# Altium schematic sheet Current Voltage Sensors.SchDoc
size A4
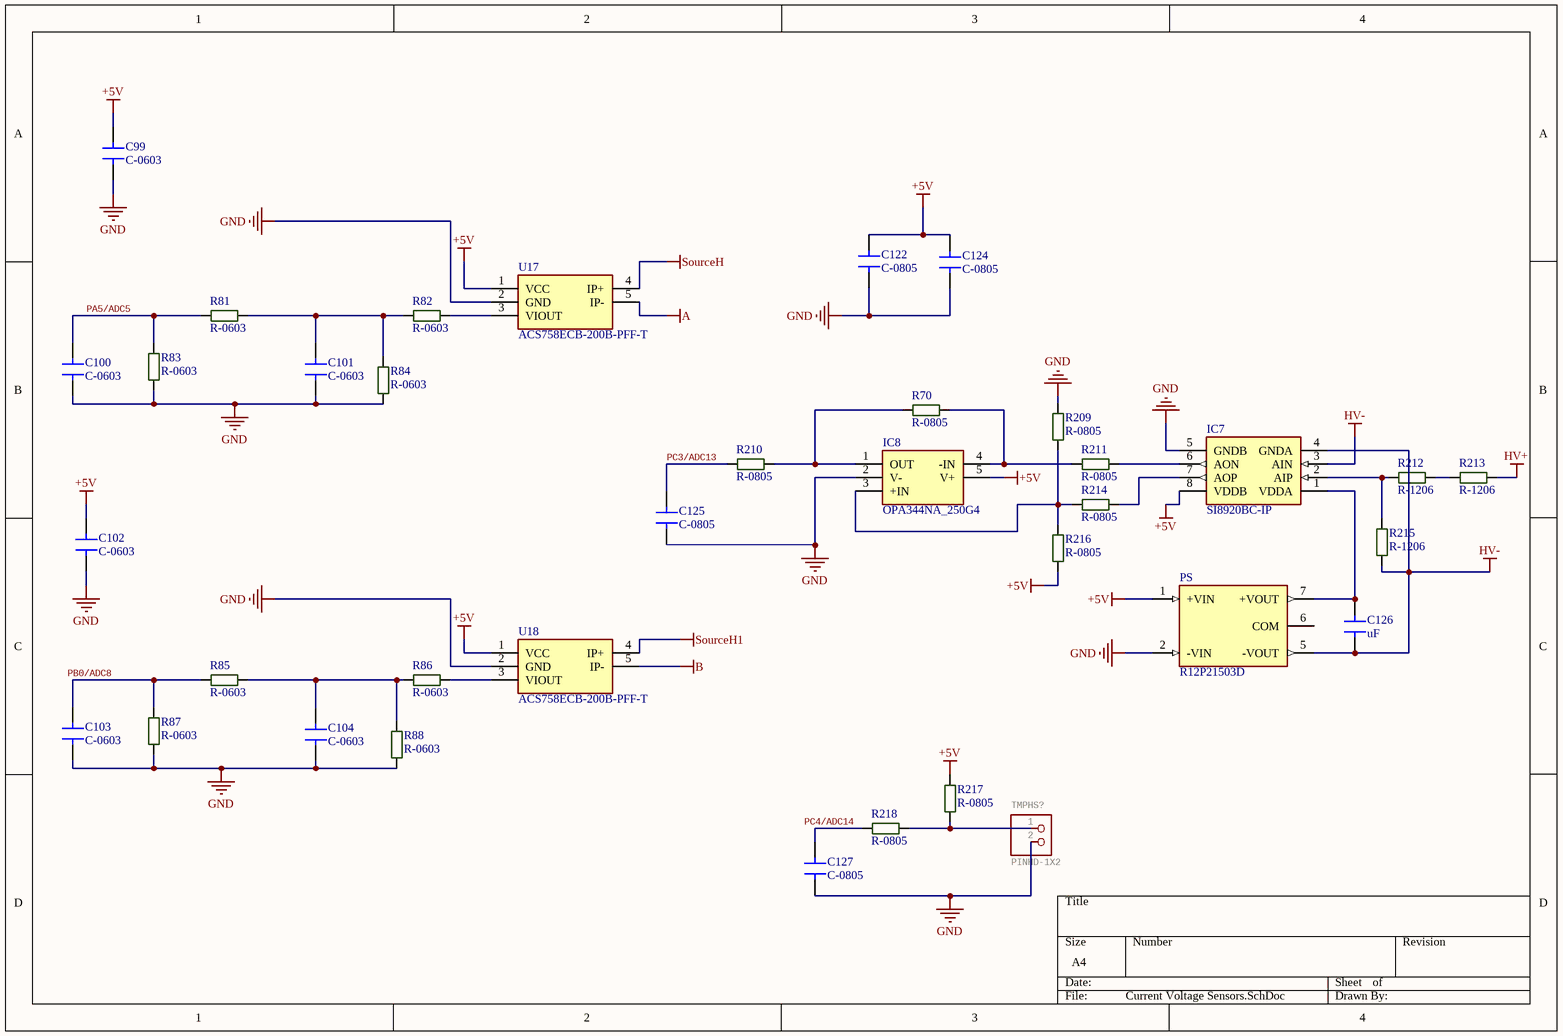
[diagram p0: Current Voltage Sensors.SchDoc]

## Parts
C99  C-0603  [C-0603W]
C100  C-0603  [C-0603W]
C101  C-0603  [C-0603W]
C102  C-0603  [C-0603W]
C103  C-0603  [C-0603W]
C104  C-0603  [C-0603W]
C122  C-0805  [C-0805]
C124  C-0805  [C-0805]
C125  C-0805  [C-0805]
C126  uF  [C-1206]
C127  C-0805  [C-0805]
IC7  SI8920BC-IP  [SOP254P965X419-8N]
IC8  OPA344NA_250G4  [SOT95P280X145-5N]
PS  R12P21503D  [CONV_R12P21503D]
R70  R-0805  [R-0805]
R81  R-0603  [R-0603R]
R82  R-0603  [R-0603R]
R83  R-0603  [R-0603R]
R84  R-0603  [R-0603R]
R85  R-0603  [R-0603R]
R86  R-0603  [R-0603R]
R87  R-0603  [R-0603R]
R88  R-0603  [R-0603R]
R209  R-0805  [R-0805]
R210  R-0805  [R-0805]
R211  R-0805  [R-0805]
R212  R-1206  [R-1206]
R213  R-1206  [R-1206]
R214  R-0805  [R-0805]
R215  R-1206  [R-1206]
R216  R-0805  [R-0805]
R217  R-0805  [R-0805]
R218  R-0805  [R-0805]
TMPHS?  PINHD-1X2  [1X02]
U17  ACS758ECB-200B-PFF-T  [ACS756SCA-050B-PFF-T_2]
U18  ACS758ECB-200B-PFF-T  [ACS756SCA-050B-PFF-T_2]

## Nets
+5V: C99.2 C102.2 C122.2 C124.2 IC7.8(VDDB) IC8.5(V+) PS.1(+VIN) R216.1 R217.1 U17.1(VCC) U18.1(VCC)
A: U17.5(IP-)
B: U18.5(IP-)
GND: C99.1 C100.1 C101.1 C102.1 C103.1 C104.1 C122.1 C124.1 C125.1 C127.1 IC7.5(GNDB) IC8.2(V-) PS.2(-VIN) R83.1 R84.1 R87.1 R88.1 R209.2 TMPHS?.2 U17.2(GND) U18.2(GND)
HV+: R213.2
HV-: C126.1 IC7.3(AIN) IC7.4(GNDA) PS.5(-VOUT) R215.1
SourceH: U17.4(IP+)
SourceH1: U18.4(IP+)
PA5/ADC5: C100.2 R81.1 R83.2
PB0/ADC8: C103.2 R85.1 R87.2
PC3/ADC13: C125.2 R210.2
PC4/ADC14: C127.2 R218.2
NetC101_2: C101.2 R81.2 R82.1 R84.2
NetC104_2: C104.2 R85.2 R86.1 R88.2
NetC126_2: C126.2 IC7.1(VDDA) PS.7(+VOUT)
NetIC7_2: IC7.2(AIP) R212.1 R215.2
NetIC7_6: IC7.6(AON) R211.2
NetIC7_7: IC7.7(AOP) R214.2
NetIC8_1: IC8.1(OUT) R70.2 R210.1
NetIC8_3: IC8.3(+IN) R209.1 R214.1 R216.2
NetIC8_4: IC8.4(-IN) R70.1 R211.1
NetR82_2: R82.2 U17.3(VIOUT)
NetR86_2: R86.2 U18.3(VIOUT)
NetR212_2: R212.2 R213.1
NetR217_2: R217.2 R218.1 TMPHS?.1

Not connected (* = marked no-connect by the designer): PS 6(COM)

## Library data of the parts
C126 = C-1206
IC7 = SI8920BC-IP: Integrated Circuit; Manufacturer_Name: Silicon Labs; Datasheet Link: https://mouser.componentsearchengine.com/Datasheets/2/SI8920BC-IP.pdf; Height: 4.19mm; Manufacturer_Part_Number: SI8920BC-IP; Mouser Part Number: 634-SI8920BC-IP; Mouser Price/Stock: https://www.mouser.co.uk/ProductDetail/Silicon-Labs/SI8920BC-IP?qs=bB7QTEcmLuN2VIVidYwh9w%3D%3D; Arrow Part Number: SI8920BC-IP; Arrow Price/Stock: https://www.arrow.com/en/products/si8920bc-ip/silicon-labs?region=nac
IC8 = OPA344NA_250G4: Integrated Circuit; Manufacturer_Name: Texas Instruments; Manufacturer_Part_Number: OPA344NA/250G4; Datasheet Link: http://www.ti.com/lit/ds/symlink/opa344.pdf; Height: 1.45mm; Mouser Part Number: 595-OPA344NA/250G4; Mouser Price/Stock: https://www.mouser.co.uk/ProductDetail/Texas-Instruments/OPA344NA-250G4?qs=7nS3%252BbEUL6s62po7Pq3eXQ%3D%3D; Arrow Part Number: OPA344NA/250G4; Arrow Price/Stock: https://www.arrow.com/en/products/opa344na250g4/texas-instruments?region=nac
PS = R12P21503D: 2W DC/DC-Converter 'ECONOLINE' SIP7 6.4kV unreg; MF: Recom Power; SnapEDA_Link: https://www.snapeda.com/parts/R12P21503D/Recom%20Power/view-part/1592429/?ref=snap; Value: *; Digi-Key_Purchase_URL: https://www.digikey.ca/product-detail/en/recom-power/R12P21503D/945-3069-5-ND/7354331?utm_source=snapeda&utm_medium=aggregator&utm_campaign=symbol; Digi-Key_Part_Number: 945-3069-5-ND; MP: R12P21503D; Package: SIP-7 Recom Power
R212 R213 R215 = R-1206: Res1206
TMPHS? = PINHD-1X2: PIN HEADER; GateName_1: G$1; SymbolName_1: PINHD2; LibraryName: pinhead; DeviceSetName: PINHD-1X2
U17 U18 = ACS758ECB-200B-PFF-T: Undefined or Miscellaneous; Manufacturer_Name: Allegro Microsystems; Datasheet Link: http://www.farnell.com/datasheets/926109.pdf; Manufacturer_Part_Number: ACS758ECB-200B-PFF-T; Arrow Part Number: ACS758ECB-200B-PFF-T; Arrow Price/Stock: https://www.arrow.com/en/products/acs758ecb-200b-pff-t/allegro-microsystems